# Altium schematic sheet ATmega328PU.SchDoc
size A4; SheetNumber: 5; SheetTotal: 5
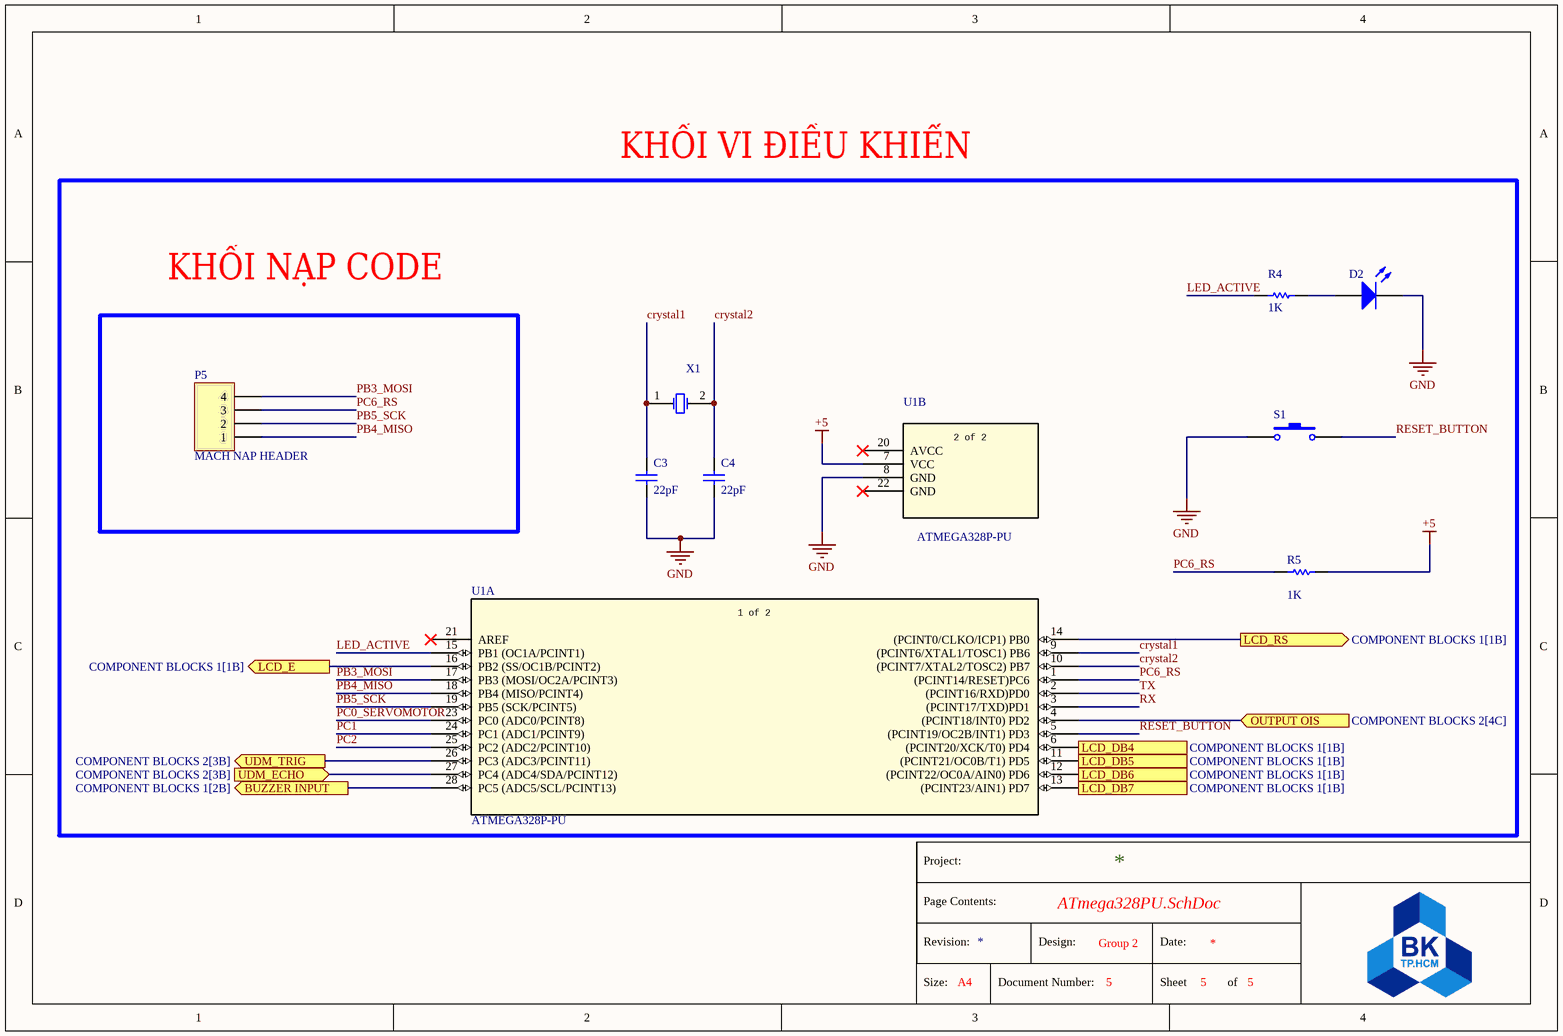
[diagram p0: ATmega328PU.SchDoc]

## Parts
C3  value 22pF  [RAD-0.3]  (hidden comment: Cap)
C4  value 22pF  [RAD-0.3]  (hidden comment: Cap)
D2  LED1  [LED-1]  (value not drawn)
P5  MACH NAP HEADER  [HDR1X4]
R4  value 1K  [AXIAL-0.3]  (hidden comment: Res1)
R5  value 1K  [AXIAL-0.3]  (hidden comment: Res1)
S1  SW-PB  [SPST-2]  (value not drawn)
U1  ATMEGA328P-PU  [28P3_ATM]  (parts A,B of 2)
X1  XTAL  [R38]  (value not drawn)

## Ports
BUZZER INPUT (out, see COMPONENT BLOCKS 1[2B]), LCD_DB4 (out, see COMPONENT BLOCKS 1[1B]), LCD_DB5 (out, see COMPONENT BLOCKS 1[1B]), LCD_DB6 (out, see COMPONENT BLOCKS 1[1B]), LCD_DB7 (out, see COMPONENT BLOCKS 1[1B]), LCD_E (out, see COMPONENT BLOCKS 1[1B]), LCD_RS (out, see COMPONENT BLOCKS 1[1B]), OUTPUT OIS (in, see COMPONENT BLOCKS 2[4C]), UDM_ECHO (in, see COMPONENT BLOCKS 2[3B]), UDM_TRIG (out, see COMPONENT BLOCKS 2[3B])

## Nets
+5: R5.2 U1.7(VCC)
GND: C3.1 C4.1 D2.2(K) S1.1 U1.8(GND)
BUZZER INPUT: U1.28(PC5_(ADC5/SCL/PCINT13)) ; port BUZZER INPUT
crystal1: C3.2 U1.9((PCINT6/XTAL1/TOSC1)_PB6) X1.1(OSC1)
crystal2: C4.2 U1.10((PCINT7/XTAL2/TOSC2)_PB7) X1.2(OSC2)
LCD_DB4: U1.6((PCINT20/XCK/T0)_PD4) ; port LCD_DB4
LCD_DB5: U1.11((PCINT21/OC0B/T1)_PD5) ; port LCD_DB5
LCD_DB6: U1.12((PCINT22/OC0A/AIN0)_PD6) ; port LCD_DB6
LCD_DB7: U1.13((PCINT23/AIN1)_PD7) ; port LCD_DB7
LCD_E: U1.16(PB2_(SS/OC1B/PCINT2)) ; port LCD_E
LCD_RS: U1.14((PCINT0/CLKO/ICP1)_PB0) ; port LCD_RS
LED_ACTIVE: R4.1 U1.15(PB1_(OC1A/PCINT1))
OUTPUT OIS: U1.4((PCINT18/INT0)_PD2) ; port OUTPUT OIS
PB3_MOSI: P5.4 U1.17(PB3_(MOSI/OC2A/PCINT3))
PB4_MISO: P5.1 U1.18(PB4_(MISO/PCINT4))
PB5_SCK: P5.2 U1.19(PB5_(SCK/PCINT5))
PC0_SERVOMOTOR: U1.23(PC0_(ADC0/PCINT8))
PC1: U1.24(PC1_(ADC1/PCINT9))
PC2: U1.25(PC2_(ADC2/PCINT10))
PC6_RS: P5.3 R5.1 U1.1((PCINT14/RESET)PC6)
RESET_BUTTON: S1.2 U1.5((PCINT19/OC2B/INT1)_PD3)
RX: U1.3((PCINT17/TXD)PD1)
TX: U1.2((PCINT16/RXD)PD0)
UDM_ECHO: U1.27(PC4_(ADC4/SDA/PCINT12)) ; port UDM_ECHO
UDM_TRIG: U1.26(PC3_(ADC3/PCINT11)) ; port UDM_TRIG
NetD2_1: D2.1(A) R4.2

Not connected (* = marked no-connect by the designer): U1 20(AVCC)* 21(AREF)* 22(GND)*

## Notes on the sheet
- KHỐI VI ĐIỀU KHIỂN
- KHỐI NẠP CODE
- Project:
- Page Contents:
- Revision:
- Size:
- A4
- Document Number:
- Design:
- Group 2
- Date:
- Sheet
- of
- (in symbol ATMEGA328P-PU, part A) 1 of 2
- (in symbol ATMEGA328P-PU, part B) 2 of 2

## Library data of the parts
C3 C4 = Cap: Capacitor; Published: 8-Jun-2000; LatestRevisionDate: 17-Jul-2002; LatestRevisionNote: Re-released for DXP Platform.; PackageReference: RAD-0.3; Publisher: Altium Limited; PackageDescription: Radial Cap, Thru-Hole; 2 Leads; 0.3 in Pin Spacing
D2 = LED1: Typical RED GaAs LED; Published: 8-Jun-2000; LatestRevisionDate: 08-Jul-2005; LatestRevisionNote: Mech Layer 1 removed.; PackageReference: LED-1; Publisher: Altium Limited; PackageDescription: LED; 2 Leads
P5 = Header 4: Header, 4-Pin; LatestRevisionDate: 17-Jul-2002; LatestRevisionNote: Re-released for DXP Platform.; Publisher: Altium Limited
R4 R5 = Res1: Resistor; Published: 8-Jun-2000; LatestRevisionDate: 17-Jul-2002; LatestRevisionNote: Re-released for DXP Platform.; PackageReference: AXIAL-0.3; Publisher: Altium Limited; PackageDescription: Axial Device, Thru-Hole; 2 Leads; 0.3 in Pin Spacing
S1 = SW-PB: Switch; Published: 24-Mar-1999; LatestRevisionDate: 17-Jul-2002; LatestRevisionNote: Re-released for DXP Platform.; PackageReference: SPST-2; Publisher: Altium Limited; PackageDescription: Switch; 2 Leads
U1 = ATMEGA328P-PU: Description; Manufacturer_Name: Microchip; Copyright: Copyright (C) 2025 Ultra Librarian. All rights reserved.; Manufacturer_Part_Number: ATMEGA328P-PU; RefDes: RefDes; Type: Type
X1 = XTAL: Crystal Oscillator; Published: 8-Jun-2000; LatestRevisionDate: 17-Jul-2002; LatestRevisionNote: Re-released for DXP Platform.; PackageReference: R38; Publisher: Altium Limited; PackageDescription: Crystal, Thru-Hole; 2 Leads; Body 3.1 x 8.2 mm (Dia.xH)